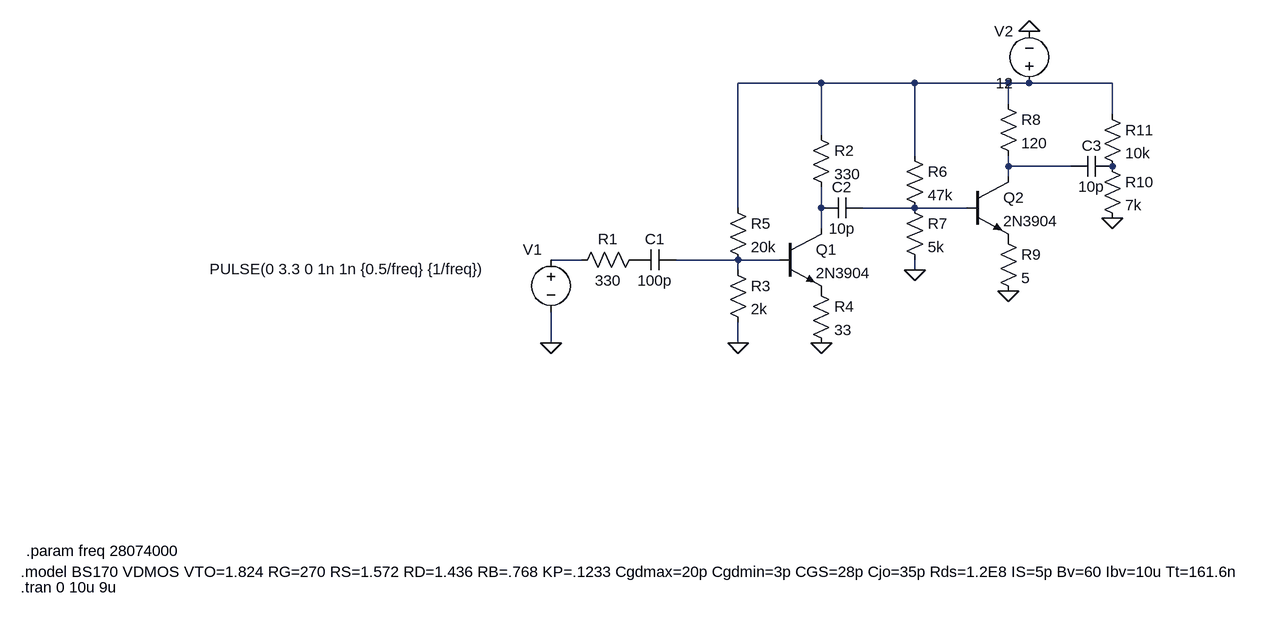
[diagram p0: schematic Draft3.asc]
Draft3.asc, the LTspice schematic file:
Version 4
SHEET 1 1696 680
WIRE 736 -160 608 -160
WIRE 880 -160 736 -160
WIRE 1024 -160 880 -160
WIRE 1056 -160 1024 -160
WIRE 1184 -160 1056 -160
WIRE 1024 -128 1024 -160
WIRE 1184 -112 1184 -160
WIRE 736 -80 736 -160
WIRE 880 -48 880 -160
WIRE 1024 -32 1024 -48
WIRE 1120 -32 1024 -32
WIRE 1024 -16 1024 -32
WIRE 608 32 608 -160
WIRE 736 32 736 0
WIRE 880 32 800 32
WIRE 960 32 880 32
WIRE 736 64 736 32
WIRE 368 112 320 112
WIRE 608 112 512 112
WIRE 672 112 608 112
WIRE 608 128 608 112
WIRE 880 128 880 112
WIRE 320 240 320 192
WIRE 608 240 608 208
FLAG 736 240 0
FLAG 320 240 0
FLAG 608 240 0
FLAG 1056 -240 0
FLAG 880 128 0
FLAG 1024 160 0
FLAG 1184 48 0
SYMBOL voltage 320 96 R0
WINDOW 0 -43 0 Left 2
WINDOW 3 -525 30 Left 2
WINDOW 123 0 0 Left 0
WINDOW 39 0 0 Left 0
SYMATTR InstName V1
SYMATTR Value PULSE(0 3.3 0 1n 1n {0.5/freq} {1/freq})
SYMBOL res 464 96 R90
WINDOW 0 0 56 VBottom 2
WINDOW 3 32 56 VTop 2
SYMATTR InstName R1
SYMATTR Value 330
SYMBOL npn 672 64 R0
SYMATTR InstName Q1
SYMATTR Value 2N3904
SYMBOL res 720 -96 R0
SYMATTR InstName R2
SYMATTR Value 330
SYMBOL voltage 1056 -144 R180
WINDOW 0 24 96 Left 2
WINDOW 3 24 16 Left 2
WINDOW 123 0 0 Left 0
WINDOW 39 0 0 Left 0
SYMATTR InstName V2
SYMATTR Value 12
SYMBOL res 592 112 R0
SYMATTR InstName R3
SYMATTR Value 2k
SYMBOL res 720 144 R0
SYMATTR InstName R4
SYMATTR Value 33
SYMBOL res 592 16 R0
SYMATTR InstName R5
SYMATTR Value 20k
SYMBOL cap 512 96 R90
WINDOW 0 0 32 VBottom 2
WINDOW 3 32 32 VTop 2
SYMATTR InstName C1
SYMATTR Value 100p
SYMBOL cap 800 16 R90
WINDOW 0 0 32 VBottom 2
WINDOW 3 32 32 VTop 2
SYMATTR InstName C2
SYMATTR Value 10p
SYMBOL res 864 -64 R0
SYMATTR InstName R6
SYMATTR Value 47k
SYMBOL res 864 16 R0
SYMATTR InstName R7
SYMATTR Value 5k
SYMBOL npn 960 -16 R0
SYMATTR InstName Q2
SYMATTR Value 2N3904
SYMBOL res 1008 -144 R0
SYMATTR InstName R8
SYMATTR Value 120
SYMBOL res 1008 64 R0
SYMATTR InstName R9
SYMATTR Value 5
SYMBOL res 1168 -48 R0
SYMATTR InstName R10
SYMATTR Value 7k
SYMBOL res 1168 -128 R0
SYMATTR InstName R11
SYMATTR Value 10k
SYMBOL cap 1184 -48 R90
WINDOW 0 0 32 VBottom 2
WINDOW 3 32 32 VTop 2
SYMATTR InstName C3
SYMATTR Value 10p
TEXT -496 592 Left 2 !.model BS170 VDMOS VTO=1.824 RG=270 RS=1.572 RD=1.436 RB=.768 KP=.1233 Cgdmax=20p Cgdmin=3p CGS=28p Cjo=35p Rds=1.2E8 IS=5p Bv=60 Ibv=10u Tt=161.6n
TEXT -496 616 Left 2 !.tran 0 10u 9u
TEXT -488 560 Left 2 !.param freq 28074000

The netlist it stands for:
* Draft3.asc
V1 N005 0 PULSE(0 3.3 0 1n 1n {0.5/freq} {1/freq})
R1 P001 N005 330
Q1 N003 N006 P002 0 2N3904
R2 N001 N003 330
V2 N001 0 12
R3 N006 0 2k
R4 P002 0 33
R5 N001 N006 20k
C1 N006 P001 100p
C2 N004 N003 10p
R6 N001 N004 47k
R7 N004 0 5k
Q2 N002 N004 P003 0 2N3904
R8 N001 N002 120
R9 P003 0 5
R10 P004 0 7k
R11 N001 P004 10k
C3 P004 N002 10p
.model NPN NPN
.model PNP PNP
.lib standard.bjt
.model BS170 VDMOS VTO=1.824 RG=270 RS=1.572 RD=1.436 RB=.768 KP=.1233 Cgdmax=20p Cgdmin=3p CGS=28p Cjo=35p Rds=1.2E8 IS=5p Bv=60 Ibv=10u Tt=161.6n
.tran 0 10u 9u
.param freq 28074000
.backanno
.end